# Altium schematic sheet CANBUS.SchDoc
size A4; Organization: Altium Limited; Address1: L3, 12a Rodborough Rd; Address2: Frenchs Forest; Address3: NSW; Address4: Australia 2086
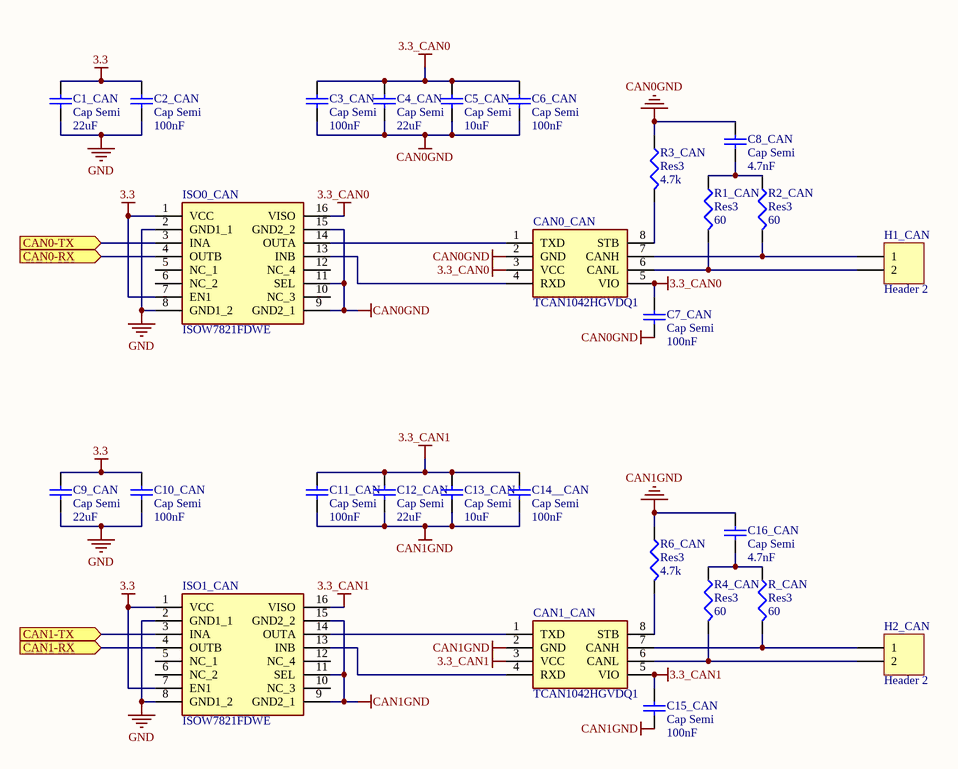
[diagram p0: CANBUS.SchDoc]

## Parts
C1_CAN  Cap Semi  value 22uF  [1608[0603]]
C2_CAN  Cap Semi  value 100nF  [1608[0603]]
C3_CAN  Cap Semi  value 100nF  [1608[0603]]
C4_CAN  Cap Semi  value 22uF  [1608[0603]]
C5_CAN  Cap Semi  value 10uF  [1608[0603]]
C6_CAN  Cap Semi  value 100nF  [1608[0603]]
C7_CAN  Cap Semi  value 100nF  [1608[0603]]
C8_CAN  Cap Semi  value 4.7nF  [1608[0603]]
C9_CAN  Cap Semi  value 22uF  [1608[0603]]
C10_CAN  Cap Semi  value 100nF  [1608[0603]]
C11_CAN  Cap Semi  value 100nF  [1608[0603]]
C12_CAN  Cap Semi  value 22uF  [1608[0603]]
C13_CAN  Cap Semi  value 10uF  [1608[0603]]
C14__CAN  Cap Semi  value 100nF  [1608[0603]]
C15_CAN  Cap Semi  value 100nF  [1608[0603]]
C16_CAN  Cap Semi  value 4.7nF  [1608[0603]]
CAN0_CAN  TCAN1042HGVDQ1  [SOIC127P600X175-8N]
CAN1_CAN  TCAN1042HGVDQ1  [SOIC127P600X175-8N]
H1_CAN  Header 2  [HDR1X2]
H2_CAN  Header 2  [HDR1X2]
ISO0_CAN  ISOW7821FDWE  [SOIC127P1030X265-16N]
ISO1_CAN  ISOW7821FDWE  [SOIC127P1030X265-16N]
R1_CAN  Res3  value 60  [J1-0603]
R2_CAN  Res3  value 60  [J1-0603]
R3_CAN  Res3  value 4.7k  [J1-0603]
R4_CAN  Res3  value 60  [J1-0603]
R6_CAN  Res3  value 4.7k  [J1-0603]
R_CAN  Res3  value 60  [J1-0603]

## Ports
CAN0-RX, CAN0-TX, CAN1-RX, CAN1-TX

## Nets
3.3: C1_CAN.2 C2_CAN.2 C9_CAN.2 C10_CAN.2 ISO0_CAN.1(VCC) ISO0_CAN.7(EN1) ISO1_CAN.1(VCC) ISO1_CAN.7(EN1)
3.3_CAN0: C3_CAN.2 C4_CAN.2 C5_CAN.2 C6_CAN.2 C7_CAN.2 CAN0_CAN.3(VCC) CAN0_CAN.5(VIO) ISO0_CAN.16(VISO)
3.3_CAN1: C11_CAN.2 C12_CAN.2 C13_CAN.2 C14__CAN.2 C15_CAN.2 CAN1_CAN.3(VCC) CAN1_CAN.5(VIO) ISO1_CAN.16(VISO)
CAN0GND: C3_CAN.1 C4_CAN.1 C5_CAN.1 C6_CAN.1 C7_CAN.1 C8_CAN.2 CAN0_CAN.2(GND) ISO0_CAN.9(GND2_1) ISO0_CAN.11(SEL) ISO0_CAN.15(GND2_2) R3_CAN.1
CAN1GND: C11_CAN.1 C12_CAN.1 C13_CAN.1 C14__CAN.1 C15_CAN.1 C16_CAN.2 CAN1_CAN.2(GND) ISO1_CAN.9(GND2_1) ISO1_CAN.11(SEL) ISO1_CAN.15(GND2_2) R6_CAN.1
GND: C1_CAN.1 C2_CAN.1 C9_CAN.1 C10_CAN.1 ISO0_CAN.2(GND1_1) ISO0_CAN.8(GND1_2) ISO1_CAN.2(GND1_1) ISO1_CAN.8(GND1_2)
CAN0-RX: ISO0_CAN.4(OUTB) ; port CAN0-RX
CAN0-TX: ISO0_CAN.3(INA) ; port CAN0-TX
CAN1-RX: ISO1_CAN.4(OUTB) ; port CAN1-RX
CAN1-TX: ISO1_CAN.3(INA) ; port CAN1-TX
NetC8_CAN_1: C8_CAN.1 R1_CAN.1 R2_CAN.1
NetC16_CAN_1: C16_CAN.1 R4_CAN.1 R_CAN.1
NetCAN0_CAN_1: CAN0_CAN.1(TXD) ISO0_CAN.14(OUTA)
NetCAN0_CAN_4: CAN0_CAN.4(RXD) ISO0_CAN.13(INB)
NetCAN0_CAN_6: CAN0_CAN.6(CANL) H1_CAN.2 R1_CAN.2
NetCAN0_CAN_7: CAN0_CAN.7(CANH) H1_CAN.1 R2_CAN.2
NetCAN0_CAN_8: CAN0_CAN.8(STB) R3_CAN.2
NetCAN1_CAN_1: CAN1_CAN.1(TXD) ISO1_CAN.14(OUTA)
NetCAN1_CAN_4: CAN1_CAN.4(RXD) ISO1_CAN.13(INB)
NetCAN1_CAN_6: CAN1_CAN.6(CANL) H2_CAN.2 R4_CAN.2
NetCAN1_CAN_7: CAN1_CAN.7(CANH) H2_CAN.1 R_CAN.2
NetCAN1_CAN_8: CAN1_CAN.8(STB) R6_CAN.2

Not connected (* = marked no-connect by the designer): ISO0_CAN 5(NC_1) 6(NC_2) 10(NC_3) 12(NC_4); ISO1_CAN 5(NC_1) 6(NC_2) 10(NC_3) 12(NC_4)

## Notes on the sheet
- Title
- Size:
- Date:
- A4
- Number:
- Time:
- Revision:
- Sheet
- of
- File:

## Library data of the parts
C1_CAN C2_CAN C3_CAN C4_CAN C5_CAN C6_CAN C7_CAN C8_CAN C9_CAN C10_CAN C11_CAN C12_CAN C13_CAN C14__CAN C15_CAN C16_CAN = Cap Semi: Capacitor (Semiconductor SIM Model); Published: 8-Jun-2000; LatestRevisionDate: 29-May-2009; LatestRevisionNote: IPC-7351 Footprint Added.; PackageReference: C1206; Publisher: Altium Limited; PackageDescription: Chip Capacitor
CAN0_CAN CAN1_CAN = TCAN1042HGVDQ1: Integrated Circuit; Manufacturer_Name: Texas Instruments; Datasheet Link: http://www.ti.com/lit/gpn/tcan1042hgv-q1; Height: 1.75mm; Manufacturer_Part_Number: TCAN1042HGVDQ1; Mouser Part Number: 595-TCAN1042HGVDQ1; Mouser Price/Stock: https://www.mouser.com/Search/Refine.aspx?Keyword=595-TCAN1042HGVDQ1; RS Part Number: 1330710P; RS Price/Stock: http://uk.rs-online.com/web/p/products/1330710P
H1_CAN H2_CAN = Header 2: Header, 2-Pin; LatestRevisionDate: 17-Jul-2002; LatestRevisionNote: Re-released for DXP Platform.; Publisher: Altium Limited
ISO0_CAN ISO1_CAN = ISOW7821FDWE: Integrated Circuit; Manufacturer_Name: Texas Instruments; Datasheet Link: http://www.ti.com/lit/ds/symlink/isow7821.pdf; Height: 2.65mm; Manufacturer_Part_Number: ISOW7821FDWE; Mouser Part Number: 595-ISOW7821FDWE; Mouser Price/Stock: https://www.mouser.com/Search/Refine.aspx?Keyword=595-ISOW7821FDWE
R1_CAN R2_CAN R3_CAN R4_CAN R6_CAN R_CAN = Res3: Resistor; Published: 8-Jun-2000; LatestRevisionDate: 29-May-2009; LatestRevisionNote: IPC-7351 Footprint Added.; PackageReference: J1-0603; Publisher: Altium Limited; PackageDescription: Chip Resistor